# Altium project nRF24AP2 Asynchronous.PrjPCB
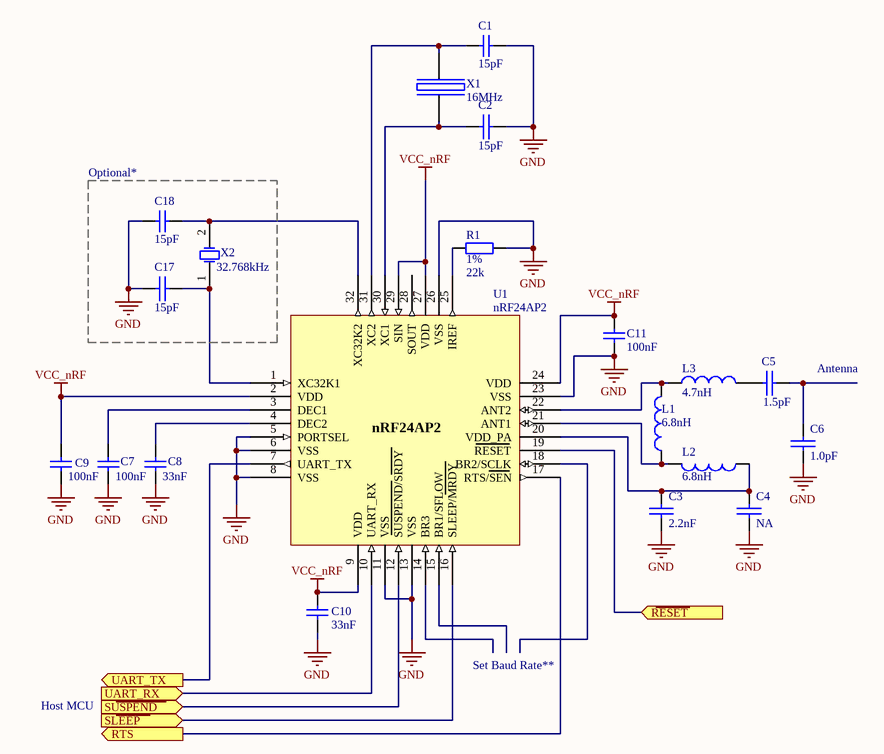
[diagram p0: nRF24AP2 Asynchronous.SchDoc]
1 sheet, 20 parts. Net scope: flat (ports and power ports of the same name join across sheets).
Board file: nRF24AP2 Asynchronous.PcbDoc

## Sheet nRF24AP2 Asynchronous.SchDoc: nRF24AP2 Asynchronous
size A4; Revision: 1.1; SheetNumber: 1; SheetTotal: 1; DrawnBy: KME; ProjectNumber: 4366

### Parts
C1  value 15pF  [0402s]  (hidden comment: NP0 50V)
C2  value 15pF  [0402s]  (hidden comment: NP0 50V)
C3  value 2.2nF  [0402s]  (hidden comment: X7R 16V)
C4  value NA  [0402s]  (hidden comment: NP0 50V)
C5  value 1.5pF  [0402s]  (hidden comment: NP0 +/-0.1pF, 50V)
C6  value 1.0pF  [0402s]  (hidden comment: NP0 +/-0.1pF, 50V)
C7  value 100nF  [0402s]  (hidden comment: X7R 16V)
C8  value 33nF  [0402s]  (hidden comment: X7R 16V)
C9  value 100nF  [0402s]  (hidden comment: X7R 16V)
C10  value 33nF  [0402s]  (hidden comment: X7R 16V)
C11  value 100nF  [0402s]  (hidden comment: X7R 16V)
C17  value 15pF  [0402s]  (hidden comment: NP0 50V)
C18  value 15pF  [0402s]  (hidden comment: NP0 50V)
L1  value 6.8nH  [0402s]  (hidden comment: Murata LQP15MN6N8B02D)
L2  value 6.8nH  [0402s]  (hidden comment: Murata LQP15MN6N8B02D)
L3  value 4.7nH  [0402s]  (hidden comment: Murata LQP15MN4N7B02D)
R1  1%  value 22k  [0402s]
U1  nRF24AP2  [Nordic_QFN50P500X500X90-33N]
X1  value 16MHz  [bt-xtal 3225]  (hidden comment: 16MHz, Cl=9pF, +/-10ppm)
X2  value 32.768kHz  [MC-146]  (hidden comment: MC-146, 32.768kHz, Cl=9pF, +/-50ppm)

### Blocks framed on the sheet
Optional*: C17 C18 X2

### Ports
RESET (in), RTS (out), SLEEP (in), SUSPEND (in), UART_RX (in), UART_TX (out)

### Nets
GND: C1.1 C2.1 C3.1 C4.1 C6.2 C7.1 C8.1 C9.1 C10.1 C11.2 C17.1 C18.1 R1.2 U1.5(PORTSEL) U1.6(VSS) U1.8(VSS) U1.11(VSS) U1.13(VSS) U1.23(VSS) U1.26(VSS) U1.33(GND) X1.2(GND) X1.4(GND)
VCC_nRF: C9.2 C10.2 C11.1 U1.2(VDD) U1.9(VDD) U1.24(VDD) U1.27(VDD) U1.29(SIN)
NetC1_2: C1.2 U1.31(XC2) X1.1(inp)
NetC2_2: C2.2 U1.30(XC1) X1.3(out)
NetC3_2: C3.2 C4.2 L2.1 U1.20(VDD_PA)
NetC5_1: C5.1 C6.1
NetC5_2: C5.2 L3.2
NetC7_2: C7.2 U1.3(DEC1)
NetC8_2: C8.2 U1.4(DEC2)
NetC17_2: C17.2 U1.1(XC32K1) X2.1(OSC1)
NetC18_2: C18.2 U1.32(XC32K2) X2.2(OSC2)
NetL1_1: L1.1 L2.2 U1.21(ANT1)
NetL1_2: L1.2 L3.1 U1.22(ANT2)
NetR1_1: R1.1 U1.25(IREF)
NetU1_7: U1.7(UART_TX) ; port UART_TX
NetU1_10: U1.10(UART_RX) ; port UART_RX
NetU1_12: U1.12(SUSPEND/SRDY) ; port SUSPEND
NetU1_16: U1.16(SLEEP/MRDY) ; port SLEEP
NetU1_17: U1.17(RTS/SEN) ; port RTS
NetU1_19: U1.19(RESET) ; port RESET

Not connected (* = marked no-connect by the designer): U1 14(BR3) 15(BR1/SFLOW) 18(BR2/SCLK) 28(SOUT)

### Notes on the sheet
- Antenna
- Set Baud Rate**
- Host MCU
- Title
- Size
- Date:
- Project Number
- Sheet         of
- Revision
- File:
- Drawn By:

### Library data of the parts
C1 C7-C11 C18 = Cap: Capacitor; Published: 8-Jun-2000; LatestRevisionDate: 17-Jul-2002; LatestRevisionNote: Re-released for DXP Platform.; PackageReference: RAD-0.3; Publisher: Altium Limited
C2-C6 C17 = Cap: Capacitor; Part Field 1: 0402
L1-L3 = Inductor: Code_IEC: 1005; Published: 8-Jun-2000; LatestRevisionDate: 17-Jul-2002; LatestRevisionNote: Re-released for DXP Platform.; PackageReference: 0402-A; Publisher: Altium Limited; Code_JEITA: 0402
R1 = Res2: Resistor; Published: 8-Jun-2000; LatestRevisionDate: 17-Jul-2002; LatestRevisionNote: Re-released for DXP Platform.; PackageReference: AXIAL-0.4; Publisher: Altium Limited
X1 = BT-XTAL: Crystal
X2 = XTAL: Crystal Oscillator; pin to pad: 2>3; Published: 8-Jun-2000; LatestRevisionDate: 17-Jul-2002; LatestRevisionNote: Re-released for DXP Platform.; PackageReference: R38; Publisher: Altium Limited